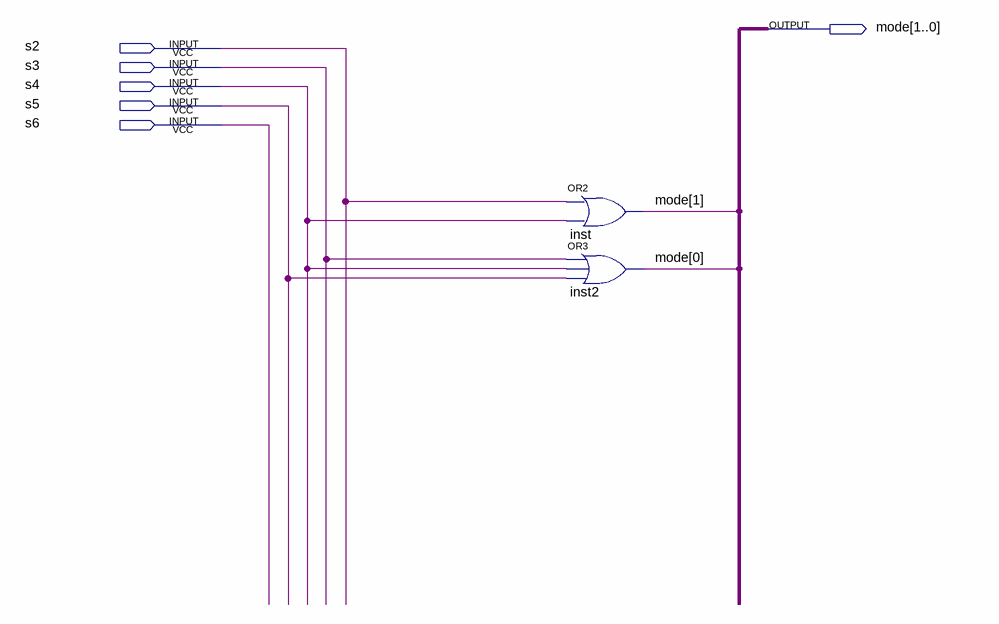
[diagram p0: schematic sheet]
// Quartus schematic triggerMode.bdf as structural Verilog: 2 symbols, 6 pins
module triggerMode (
  input  s2,
  input  s3,
  input  s4,
  input  s5,
  input  s6,
  output [1:0] mode
);

  or inst (mode[1], s2, s4);
  or inst2 (mode[0], s3, s4, s5);
endmodule
